# Altium schematic sheet 大风车.SchDoc
size A3
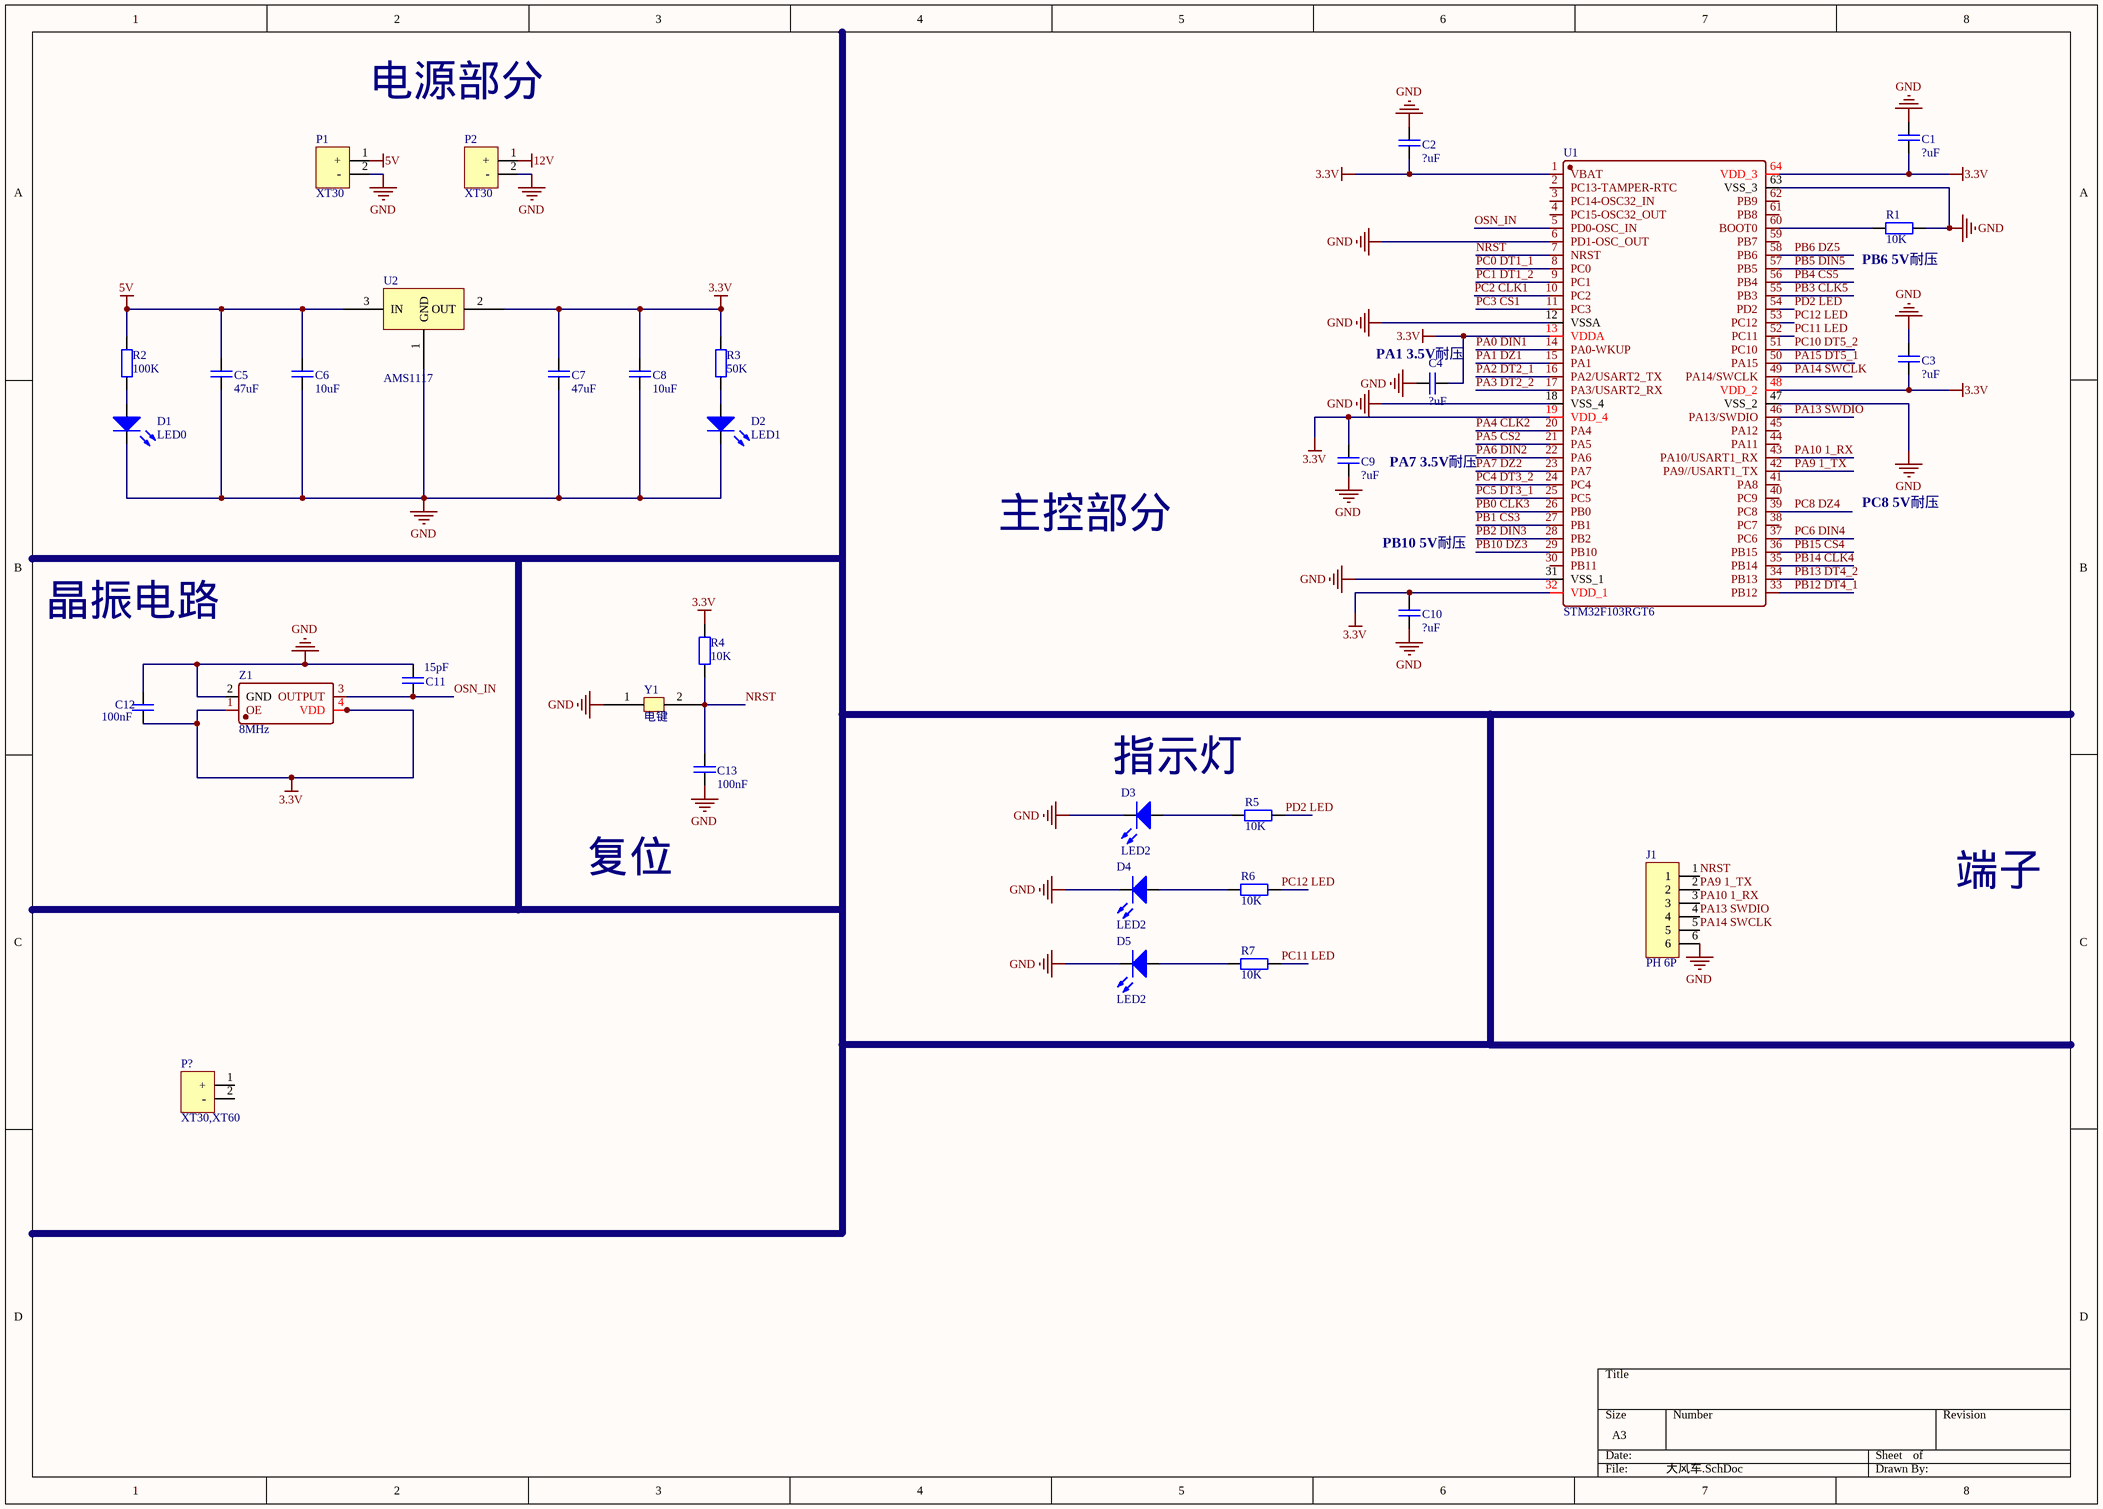
[diagram p0: 大风车.SchDoc]

## Parts
C1  ?uF  [0603_C]
C2  ?uF  [0603_C]
C3  ?uF  [0603_C]
C4  ?uF  [0603_C]
C5  47uF  [1210_C]
C6  10uF  [1210_C]
C7  47uF  [1210_C]
C8  10uF  [1210_C]
C9  ?uF  [0603_C]
C10  ?uF  [0603_C]
C11  15pF  [0603_C]
C12  100nF  [0603_C]
C13  100nF  [0603_C]
D1  LED0  [LED-0603]
D2  LED1  [LED-0603]
D3  LED2  [LED-0603]
D4  LED2  [LED-0603]
D5  LED2  [LED-0603]
J1  PH 6P  [XH 6P 2.54mm 立 贴]
P1  XT30  [XT30-F]
P2  XT30  [XT30-F]
P?  XT30,XT60  [XT30-F]
R1  10K  [0603_R]
R2  100K  [0603_R]
R3  50K  [0603_R]
R4  10K  [0603_R]
R5  10K  [0603_R]
R6  10K  [0603_R]
R7  10K  [0603_R]
U1  STM32F103RGT6  [STM32F1]
U2  AMS1117  [AMS1117]
Y1  电键  [电键]
Z1  8MHz  [OSC-SMD_4P-L2.5-W2.0-BL]

## Nets
3.3V: C1.1 C2.1 C3.1 C4.1 C7.2 C8.2 C9.2 C10.2 C12.1 R3.2 R4.2 U1.1(VBAT) U1.13(VDDA) U1.19(VDD_4) U1.32(VDD_1) U1.48(VDD_2) U1.64(VDD_3) U2.2(OUT) Z1.1(OE) Z1.4(VDD)
5V: C5.2 C6.2 P1.1(+) R2.1 U2.3(IN)
12V: P2.1(+)
GND: C1.2 C2.2 C3.2 C4.2 C5.1 C6.1 C7.1 C8.1 C9.1 C10.1 C11.2 C12.2 C13.2 D1.2(K) D2.2(K) D3.2(K) D4.2(K) D5.2(K) J1.6 P1.2(-) P2.2(-) R1.2 U1.6(PD1-OSC_OUT) U1.12(VSSA) U1.18(VSS_4) U1.31(VSS_1) U1.47(VSS_2) U1.63(VSS_3) U2.1(GND) Y1.1 Z1.2(GND)
NRST: C13.1 J1.1 R4.1 U1.7(NRST) Y1.2
OSN_IN: C11.1 U1.5(PD0-OSC_IN) Z1.3(OUTPUT)
PA0 DIN1: U1.14(PA0-WKUP)
PA1 DZ1: U1.15(PA1)
PA2 DT2_1: U1.16(PA2/USART2_TX)
PA3 DT2_2: U1.17(PA3/USART2_RX)
PA4 CLK2: U1.20(PA4)
PA5 CS2: U1.21(PA5)
PA6 DIN2: U1.22(PA6)
PA7 DZ2: U1.23(PA7)
PA9 1_TX: J1.2 U1.42(PA9//USART1_TX)
PA10 1_RX: J1.3 U1.43(PA10/USART1_RX)
PA13 SWDIO: J1.4 U1.46(PA13/SWDIO)
PA14 SWCLK: J1.5 U1.49(PA14/SWCLK)
PA15 DT5_1: U1.50(PA15)
PB0 CLK3: U1.26(PB0)
PB1 CS3: U1.27(PB1)
PB2 DIN3: U1.28(PB2)
PB3 CLK5: U1.55(PB3)
PB4 CS5: U1.56(PB4)
PB5 DIN5: U1.57(PB5)
PB6 DZ5: U1.58(PB6)
PB10 DZ3: U1.29(PB10)
PB12 DT4_1: U1.33(PB12)
PB13 DT4_2: U1.34(PB13)
PB14 CLK4: U1.35(PB14)
PB15 CS4: U1.36(PB15)
PC0 DT1_1: U1.8(PC0)
PC1 DT1_2: U1.9(PC1)
PC2 CLK1: U1.10(PC2)
PC3 CS1: U1.11(PC3)
PC4 DT3_2: U1.24(PC4)
PC5 DT3_1: U1.25(PC5)
PC6 DIN4: U1.37(PC6)
PC8 DZ4: U1.39(PC8)
PC10 DT5_2: U1.51(PC10)
PC11 LED: R7.2 U1.52(PC11)
PC12 LED: R6.2 U1.53(PC12)
PD2 LED: R5.2 U1.54(PD2)
NetD1_1: D1.1(A) R2.2
NetD2_1: D2.1(A) R3.1
NetD3_1: D3.1(A) R5.1
NetD4_1: D4.1(A) R6.1
NetD5_1: D5.1(A) R7.1
NetR1_1: R1.1 U1.60(BOOT0)

Not connected (* = marked no-connect by the designer): P? 1(+) 2(-); U1 2(PC13-TAMPER-RTC) 3(PC14-OSC32_IN) 4(PC15-OSC32_OUT) 30(PB11) 38(PC7) 40(PC9) 41(PA8) 44(PA11) 45(PA12) 59(PB7) 61(PB8) 62(PB9)

## Notes on the sheet
- 电源部分
- (near R1) PB6 5V耐压
- (near C4) PA1 3.5V耐压
- (near C9) PA7 3.5V耐压
- PC8 5V耐压
- 主控部分
- PB10 5V耐压
- 晶振电路
- (near D3) 指示灯
- 复位
- 端子

## Library data of the parts
C1-C13 = Cap: Published: 8-Jun-2000; LatestRevisionDate: 17-Jul-2002; LatestRevisionNote: Re-released for DXP Platform.; PackageReference: RAD-0.3; Publisher: Altium Limited
D1-D5 = LED0: 发光二极管; Published: 8-Jun-2000; LatestRevisionDate: 08-Jul-2005; LatestRevisionNote: Mech Layer 1 removed.; PackageReference: LED-0; Publisher: Altium Limited
P? = XT: 电源接口
R1-R7 = Res: Published: 8-Jun-2000; LatestRevisionDate: 17-Jul-2002; LatestRevisionNote: Re-released for DXP Platform.; PackageReference: AXIAL-0.4; Publisher: Altium Limited